# Altium project NUsense.PrjPCB
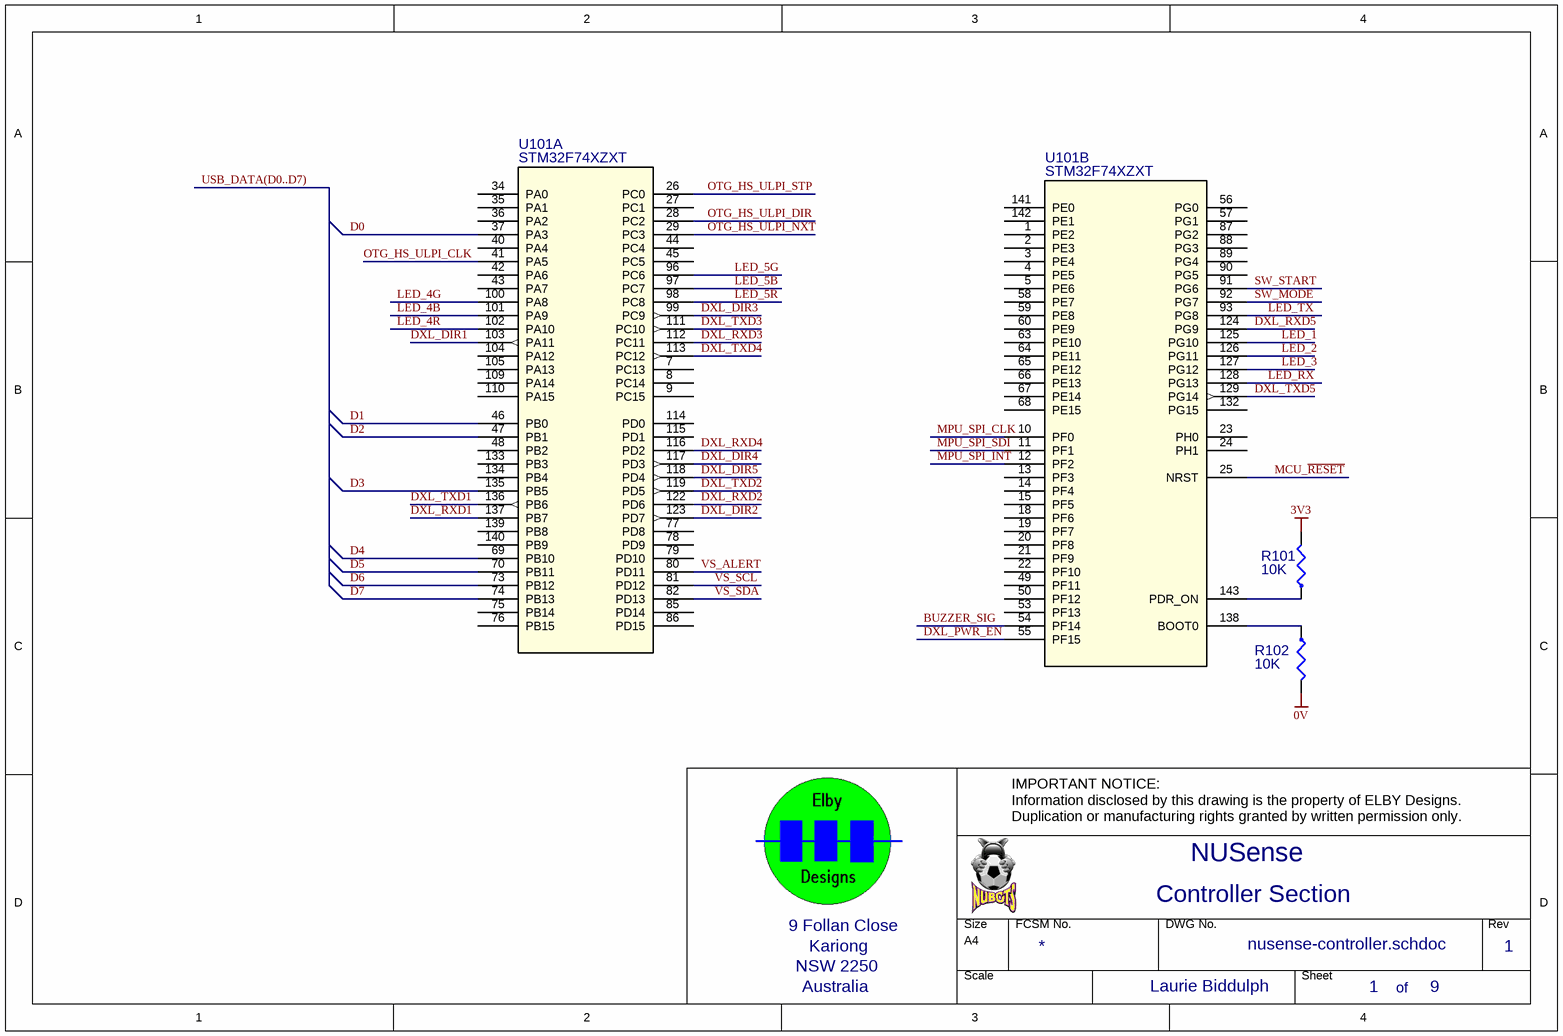
[diagram p0: nusense-controller.schdoc]
9 sheets, 204 parts. Net scope: global (net labels, ports and power ports of the same name join across sheets).
Sheets:
  nusense-controller.schdoc
  nusense-fans.schdoc
  nusense-monitors.schdoc
  nusense-mup-sensor.schdoc
  nusense-otg_hs_usb.schdoc
  nusense-power.schdoc
  nusense-power-decoupling.schdoc
  nusense-rs485.schdoc
  nusense-user-io.schdoc

## Sheet nusense-controller.schdoc: NUSense
size A4; Organization: Elby Designs; Address1: 9 Follan Close; Address2: Kariong; Address3: NSW 2250; Address4: Australia; Revision: 1; SheetNumber: 1; SheetTotal: 9; DrawnBy: Controller Section; Engineer: Laurie Biddulph; PageSetup: Record=PageOptions|CenterHorizontal=True|CenterVertical=True|PrintScale=1.38|XCorrection=1.00|YCorrection=1.00|PrintKind=1|BorderSize=5000000|LeftOffset=0|BottomOffset=0|Orientation=2|PaperLength=1000|PaperWidth=1000|Scale=100|PaperSource=7|PrintQuality=-4|MediaType=1|DitherType=10|PaperKind=A3|PrintScaleMode=1

### Parts
R101  10K  [AXIAL-0.4(LB)]
R102  10K  [AXIAL-0.4(LB)]
U101  STM32F74XZXT  [LQFP-144_20X20mm]  (parts A,B of 3)

### Nets
0V: R102.2
3V3: R101.2
BUZZER_SIG: U101.54(PF14)
D0: U101.37(PA3)
D1: U101.46(PB0)
D2: U101.47(PB1)
D3: U101.135(PB5)
D4: U101.69(PB10)
D5: U101.70(PB11)
D6: U101.73(PB12)
D7: U101.74(PB13)
DXL_DIR1: U101.103(PA11)
DXL_DIR2: U101.123(PD7)
DXL_DIR3: U101.99(PC9)
DXL_DIR4: U101.117(PD3)
DXL_DIR5: U101.118(PD4)
DXL_PWR_EN: U101.55(PF15)
DXL_RXD1: U101.137(PB7)
DXL_RXD2: U101.122(PD6)
DXL_RXD3: U101.112(PC11)
DXL_RXD4: U101.116(PD2)
DXL_RXD5: U101.124(PG9)
DXL_TXD1: U101.136(PB6)
DXL_TXD2: U101.119(PD5)
DXL_TXD3: U101.111(PC10)
DXL_TXD4: U101.113(PC12)
DXL_TXD5: U101.129(PG14)
LED_1: U101.125(PG10)
LED_2: U101.126(PG11)
LED_3: U101.127(PG12)
LED_4B: U101.101(PA9)
LED_4G: U101.100(PA8)
LED_4R: U101.102(PA10)
LED_5B: U101.97(PC7)
LED_5G: U101.96(PC6)
LED_5R: U101.98(PC8)
LED_RX: U101.128(PG13)
LED_TX: U101.93(PG8)
MCU_~{RESET}: U101.25(NRST)
MPU_SPI_CLK: U101.10(PF0)
MPU_SPI_INT: U101.12(PF2)
MPU_SPI_SDI: U101.11(PF1)
OTG_HS_ULPI_CLK: U101.41(PA5)
OTG_HS_ULPI_DIR: U101.28(PC2)
OTG_HS_ULPI_NXT: U101.29(PC3)
OTG_HS_ULPI_STP: U101.26(PC0)
SW_MODE: U101.92(PG7)
SW_START: U101.91(PG6)
VS_ALERT: U101.80(PD11)
VS_SCL: U101.81(PD12)
VS_SDA: U101.82(PD13)
NetR101_1: R101.1 U101.143(PDR_ON)
NetR102_1: R102.1 U101.138(BOOT0)

Not connected (* = marked no-connect by the designer): U101 1(PE2) 2(PE3) 3(PE4) 4(PE5) 5(PE6) 7(PC13) 8(PC14) 9(PC15) 13(PF3) 14(PF4) 15(PF5) 18(PF6) 19(PF7) 20(PF8) 21(PF9) 22(PF10) 23(PH0) 24(PH1) 27(PC1) 34(PA0) 35(PA1) 36(PA2) 40(PA4) 42(PA6) 43(PA7) 44(PC4) 45(PC5) 48(PB2) 49(PF11) 50(PF12) 53(PF13) 56(PG0) 57(PG1) 58(PE7) 59(PE8) 60(PE9) 63(PE10) 64(PE11) 65(PE12) 66(PE13) 67(PE14) 68(PE15) 75(PB14) 76(PB15) 77(PD8) 78(PD9) 79(PD10) 85(PD14) 86(PD15) 87(PG2) 88(PG3) 89(PG4) 90(PG5) 104(PA12) 105(PA13) 109(PA14) 110(PA15) 114(PD0) 115(PD1) 132(PG15) 133(PB3) 134(PB4) 139(PB8) 140(PB9) 141(PE0) 142(PE1)

### Buses and harness runs
bus USB_DATA(D0..D7)

### Notes on the sheet
- IMPORTANT NOTICE:
  Information disclosed by this drawing is the property of ELBY Designs.
  Duplication or manufacturing rights granted by written permission only.
- of

### Library data of the parts
R101 R102 = RM-10K(LB): 0.5W 1% Metal Film Resistor; EMRP: RM-10K
U101 = STM32F74XZXT: 32-bit Microcontroller; Vendor: STMicroelectronics; C: Copyright (C) 2016 Accelerated Designs. All rights reserved; Manufacturer_Part_Number: stm32f74xzxt; Copyright: Copyright (C) 2016 Accelerated Designs. All rights reserved; Value: Value; Type: Type; RefDes: RefDes

## Sheet nusense-fans.schdoc: NUSense
size A4; Organization: Elby Designs; Address1: 9 Follan Close; Address2: Kariong; Address3: NSW 2250; Address4: Australia; Revision: 1; SheetNumber: 4; SheetTotal: 9; DrawnBy: Fan Controller; Engineer: Laurie Biddulph; PageSetup: Record=PageOptions|CenterHorizontal=True|CenterVertical=True|PrintScale=1.38|XCorrection=1.00|YCorrection=1.00|PrintKind=1|BorderSize=5000000|LeftOffset=0|BottomOffset=0|Orientation=2|PaperLength=1000|PaperWidth=1000|Scale=100|PaperSource=7|PrintQuality=-4|MediaType=1|DitherType=10|PaperKind=A3|PrintScaleMode=1
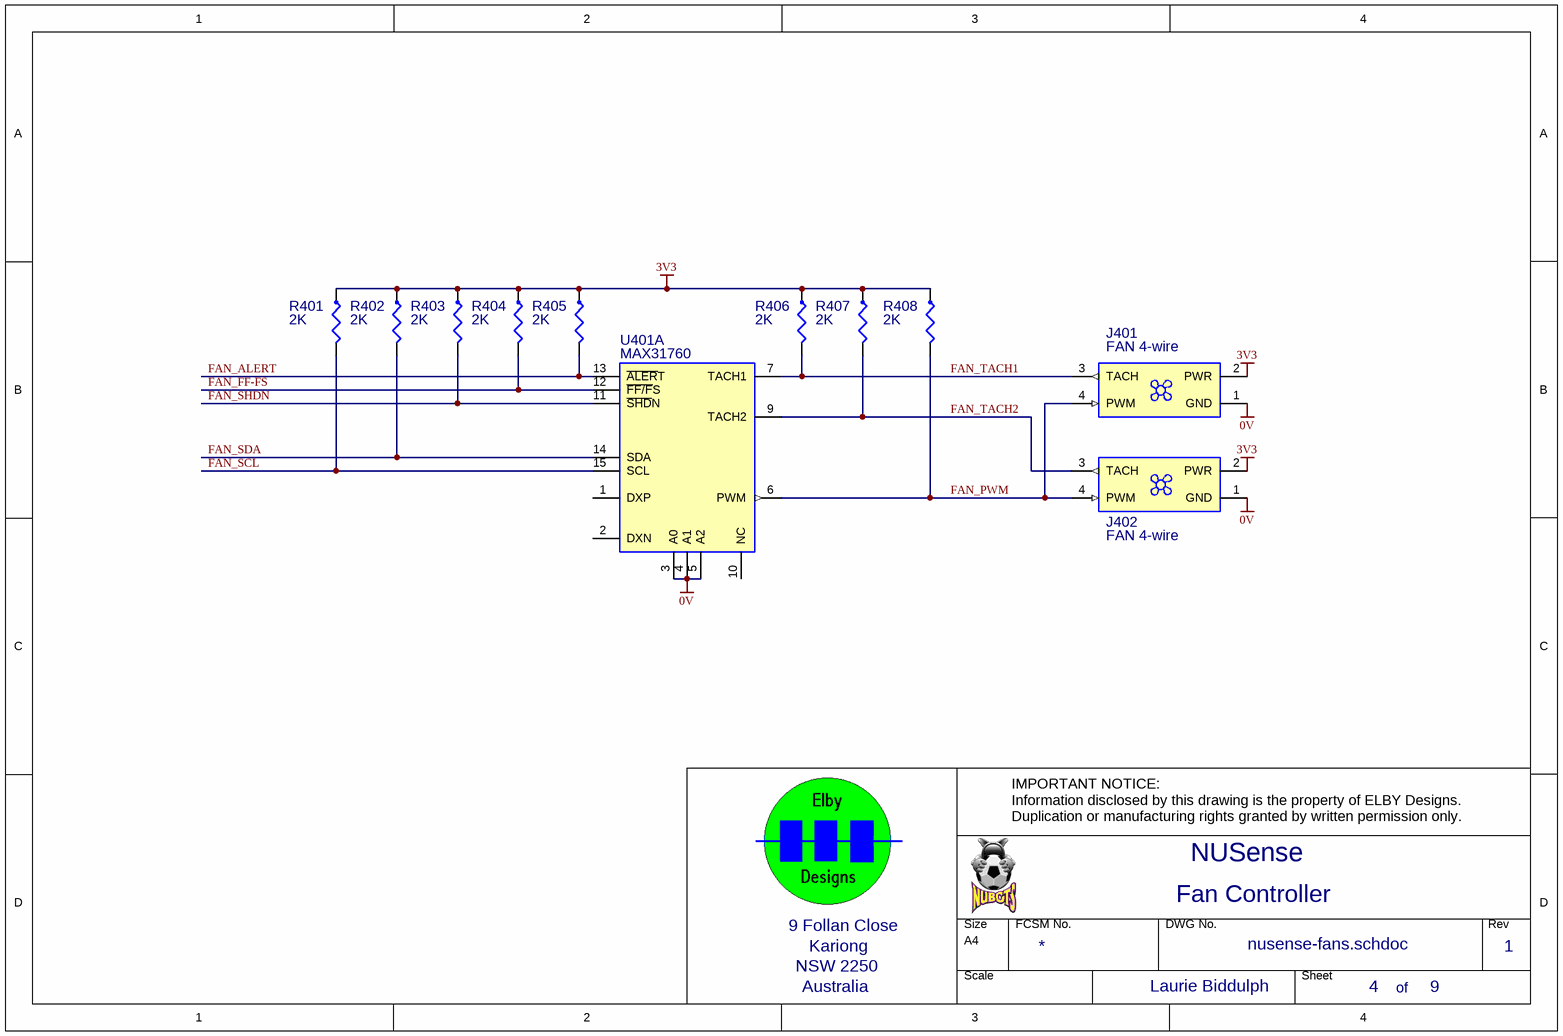
[diagram p1: nusense-fans.schdoc]

### Parts
J401  FAN 4-wire
J402  FAN 4-wire
R401  2K  [AXIAL-0.4(LB)]
R402  2K  [AXIAL-0.4(LB)]
R403  2K  [AXIAL-0.4(LB)]
R404  2K  [AXIAL-0.4(LB)]
R405  2K  [AXIAL-0.4(LB)]
R406  2K  [AXIAL-0.4(LB)]
R407  2K  [AXIAL-0.4(LB)]
R408  2K  [AXIAL-0.4(LB)]
U401  MAX31760  (part A of 2)

### Nets
0V: J401.1(GND) J402.1(GND) U401.3(A0) U401.4(A1) U401.5(A2)
3V3: J401.2(PWR) J402.2(PWR) R401.1 R402.1 R403.1 R404.1 R405.1 R406.1 R407.1 R408.1
FAN_ALERT: R405.2 U401.13(~{ALER}T)
FAN_FF-FS: R404.2 U401.12(~{FF/F}S)
FAN_PWM: J401.4(PWM) J402.4(PWM) R408.2 U401.6(PWM)
FAN_SCL: R401.2 U401.15(SCL)
FAN_SDA: R402.2 U401.14(SDA)
FAN_SHDN: R403.2 U401.11(~{SHD}N)
FAN_TACH1: J401.3(TACH) R406.2 U401.7(TACH1)
FAN_TACH2: J402.3(TACH) R407.2 U401.9(TACH2)

Not connected (* = marked no-connect by the designer): U401 1(DXP) 2(DXN) 10(NC)

### Notes on the sheet
- IMPORTANT NOTICE:
  Information disclosed by this drawing is the property of ELBY Designs.
  Duplication or manufacturing rights granted by written permission only.
- of

### Library data of the parts
J401 J402 = FAN-4wire: 4-Wire Fan
R401-R408 = RM-2K(LB): 0.5W 1% Metal Film Resistor; EMRP: RM-2K
U401 = MAX31760: Precision Fan Speed

## Sheet nusense-monitors.schdoc: NUSense
size A4; Organization: Elby Designs; Address1: 9 Follan Close; Address2: Kariong; Address3: NSW 2250; Address4: Australia; Revision: 1; SheetNumber: 0; SheetTotal: 0; DrawnBy: Current & Voltage Monitors; Engineer: Laurie Biddulph; PageSetup: Record=PageOptions|CenterHorizontal=True|CenterVertical=True|PrintScale=1.38|XCorrection=1.00|YCorrection=1.00|PrintKind=1|BorderSize=5000000|LeftOffset=0|BottomOffset=0|Orientation=2|PaperLength=1000|PaperWidth=1000|Scale=100|PaperSource=7|PrintQuality=-4|MediaType=1|DitherType=10|PaperKind=A3|PrintScaleMode=1
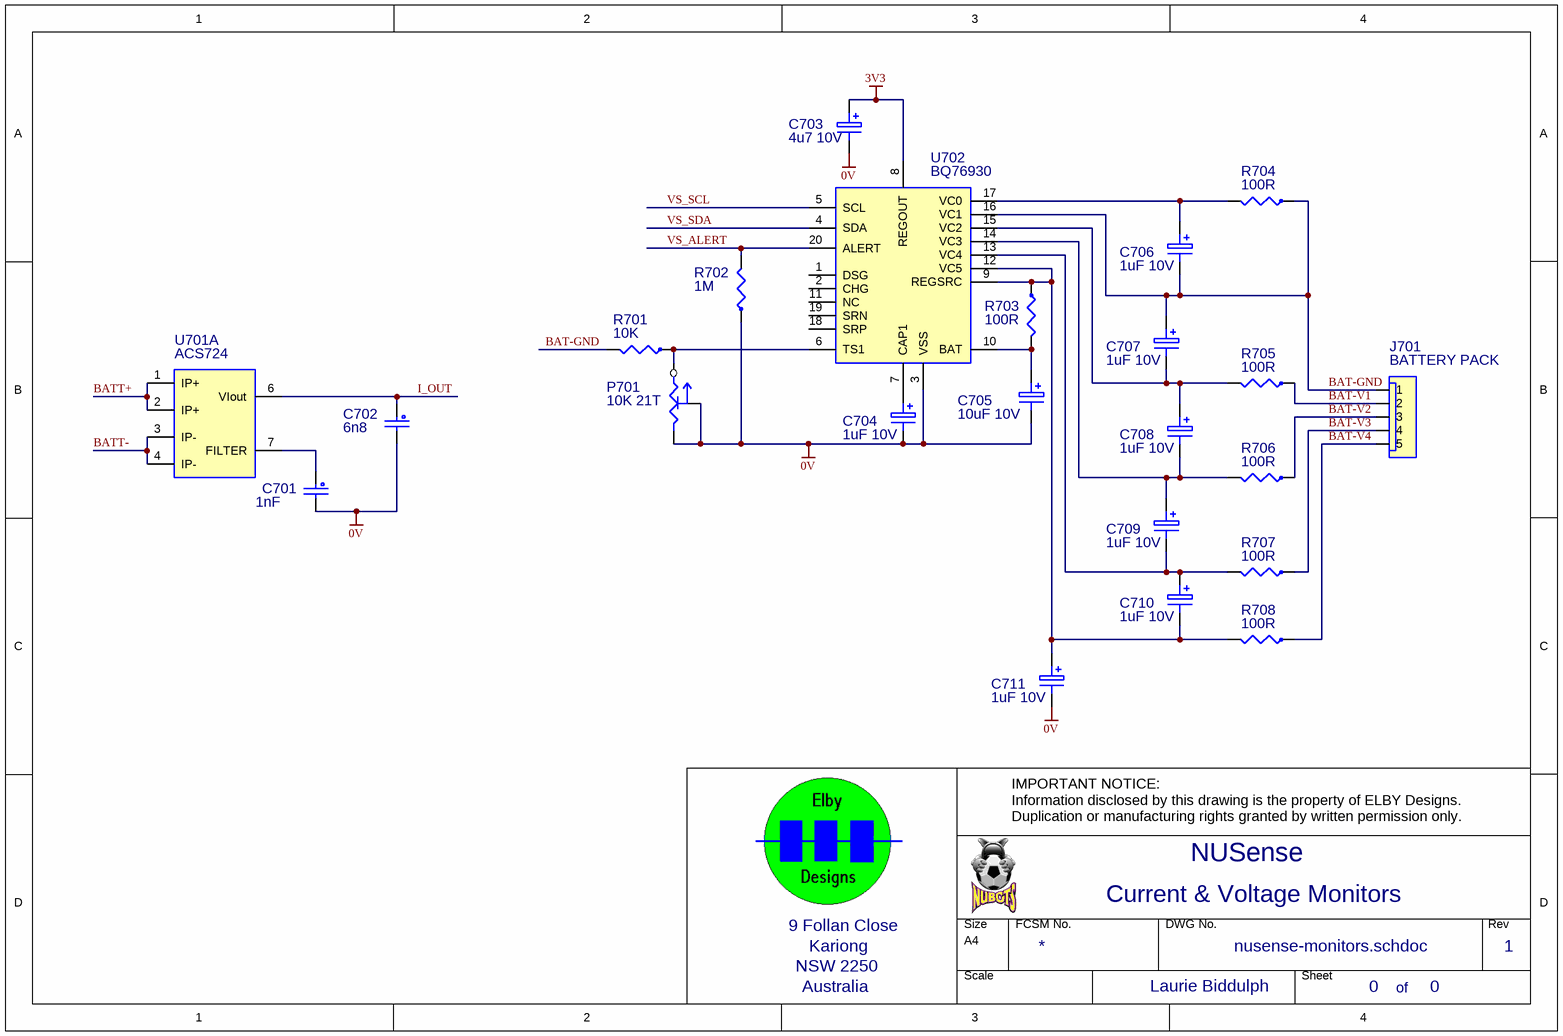
[diagram p2: nusense-monitors.schdoc]

### Parts
C701  1nF  [RAD-0.2(LB)]
C702  6n8  [RAD-0.2(LB)]
C703  4u7 10V  [RB-D5.0-P2.0]
C704  1uF 10V  [RB-D5.0-P2.0]
C705  10uF 10V  [RB-D6.3-P2.5]
C706  1uF 10V  [RB-D5.0-P2.0]
C707  1uF 10V  [RB-D5.0-P2.0]
C708  1uF 10V  [RB-D5.0-P2.0]
C709  1uF 10V  [RB-D5.0-P2.0]
C710  1uF 10V  [RB-D5.0-P2.0]
C711  1uF 10V  [RB-D5.0-P2.0]
J701  BATTERY PACK  [MTA-5V(LB)]
P701  10K 21T  [TRIMPOT(LB)]
R701  10K  [AXIAL-0.4(LB)]
R702  1M  [AXIAL-0.4(LB)]
R703  100R  [AXIAL-0.4(LB)]
R704  100R  [AXIAL-0.4(LB)]
R705  100R  [AXIAL-0.4(LB)]
R706  100R  [AXIAL-0.4(LB)]
R707  100R  [AXIAL-0.4(LB)]
R708  100R  [AXIAL-0.4(LB)]
U701  ACS724  (part A of 2)
U702  BQ76930

### Nets
0V: C701.2 C702.2 C703.2 C704.2 C705.2 C711.2 P701.1(A) P701.2(W) R702.1 U702.3(VSS)
3V3: C703.1 U702.8(REGOUT)
BAT-GND: C706.2 C707.1 J701.1 R701.2 R704.1 U702.16(VC1)
BAT-V1: J701.2 R705.1
BAT-V2: J701.3 R706.1
BAT-V3: J701.4 R707.1
BAT-V4: J701.5 R708.1
BATT+: U701.1(IP+) U701.2(IP+)
BATT-: U701.3(IP-) U701.4(IP-)
I_OUT: C702.1 U701.6(VIout)
VS_ALERT: R702.2 U702.20(ALERT)
VS_SCL: U702.5(SCL)
VS_SDA: U702.4(SDA)
NetC701_1: C701.1 U701.7(FILTER)
NetC704_1: C704.1 U702.7(CAP1)
NetC705_1: C705.1 R703.2 U702.10(BAT)
NetC706_1: C706.1 R704.2 U702.17(VC0)
NetC707_2: C707.2 C708.1 R705.2 U702.15(VC2)
NetC708_2: C708.2 C709.1 R706.2 U702.14(VC3)
NetC709_2: C709.2 C710.1 R707.2 U702.13(VC4)
NetC710_2: C710.2 C711.1 R703.1 R708.2 U702.9(REGSRC) U702.12(VC5)
NetP701_3: P701.3(C) R701.1 U702.6(TS1)

Not connected (* = marked no-connect by the designer): U702 1(DSG) 2(CHG) 11(NC) 18(SRP) 19(SRN)

### Notes on the sheet
- IMPORTANT NOTICE:
  Information disclosed by this drawing is the property of ELBY Designs.
  Duplication or manufacturing rights granted by written permission only.
- of

### Library data of the parts
C701 = CP-1NF(LB): 63V 10% Metallised Polyester; EMRP: CP-1N0F
C702 = CP-6N8F(LB): 63V 10% Metallised Polyester; EMRP: CP-6N8F
C703 = CE-4U7F50V(LB): 20% 50V Aluminium Electrolytic; EMRP: CE-4U7F
C704 C706-C711 = CE-1UF50V(LB): 20% 50V Aluminium Electrolytic; EMRP: CE-1UF
C705 = CE-10UF50V(LB): 20% 50V Aluminium Electrolytic; EMRP: CE-10UF
J701 = MTA-5V(LB): EMRP: JC-05P
P701 = RT-10K(LB): Multiturn Trimpot (Spectrol 64W); EMRP: RT-6-10K
R701 = RM-10K(LB): as R101 on sheet nusense-controller
R702 = RM-1M(LB): 0.5W 1% Metal Film Resistor; EMRP: RM-1M
R703-R708 = RM-100R(LB): 0.5W 1% Metal Film Resistor; EMRP: RM-100R
U701 = ACS724: Current Monitor
U702 = BQ76930: Battery Monitor

## Sheet nusense-mup-sensor.schdoc: NUSense
size A4; Organization: Elby Designs; Address1: 9 Follan Close; Address2: Kariong; Address3: NSW 2250; Address4: Australia; Revision: 1; SheetNumber: 2; SheetTotal: 9; DrawnBy: MPU Sensor; Engineer: Laurie Biddulph; PageSetup: Record=PageOptions|CenterHorizontal=True|CenterVertical=True|PrintScale=1.38|XCorrection=1.00|YCorrection=1.00|PrintKind=1|BorderSize=5000000|LeftOffset=0|BottomOffset=0|Orientation=2|PaperLength=1000|PaperWidth=1000|Scale=100|PaperSource=7|PrintQuality=-4|MediaType=1|DitherType=10|PaperKind=A3|PrintScaleMode=1
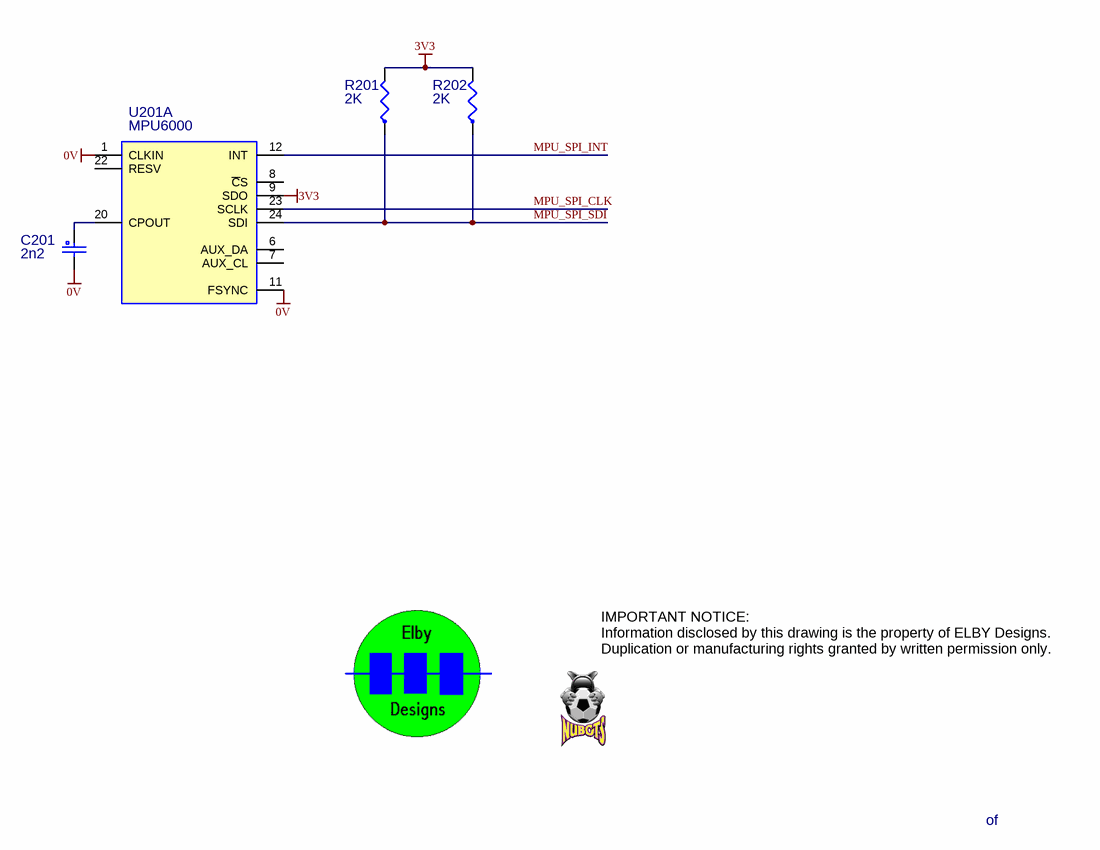
[diagram p3: nusense-mup-sensor.schdoc]

### Parts
C201  2n2  [RAD-0.2(LB)]
R201  2K  [AXIAL-0.4(LB)]
R202  2K  [AXIAL-0.4(LB)]
U201  MPU6000  (part A of 3)

### Nets
0V: C201.2 U201.1(CLKIN) U201.11(FSYNC)
3V3: R201.2 R202.2 U201.9(SDO)
MPU_SPI_CLK: U201.23(SCLK)
MPU_SPI_INT: U201.12(INT)
MPU_SPI_SDI: R201.1 R202.1 U201.24(SDI)
NetC201_1: C201.1 U201.20(CPOUT)

Not connected (* = marked no-connect by the designer): U201 6(AUX_DA) 7(AUX_CL) 8(~{C}S) 22(RESV)

### Notes on the sheet
- IMPORTANT NOTICE:
  Information disclosed by this drawing is the property of ELBY Designs.
  Duplication or manufacturing rights granted by written permission only.
- of

### Library data of the parts
C201 = CP-2N2F(LB): 63V 10% Metallised Polyester; EMRP: CP-2N2F
R201 R202 = RM-2K(LB): 0.5W 1% Metal Film Resistor; EMRP: RM-2K
U201 = MPU6000: Motion Tracking

## Sheet nusense-otg_hs_usb.schdoc: NUSense
size A4; Organization: Elby Designs; Address1: 9 Follan Close; Address2: Kariong; Address3: NSW 2250; Address4: Australia; Revision: 1; SheetNumber: 3; SheetTotal: 9; DrawnBy: USB Section; Engineer: Laurie Biddulph; PageSetup: Record=PageOptions|CenterHorizontal=True|CenterVertical=True|PrintScale=1.38|XCorrection=1.00|YCorrection=1.00|PrintKind=1|BorderSize=5000000|LeftOffset=0|BottomOffset=0|Orientation=2|PaperLength=1000|PaperWidth=1000|Scale=100|PaperSource=7|PrintQuality=-4|MediaType=1|DitherType=10|PaperKind=A3|PrintScaleMode=1
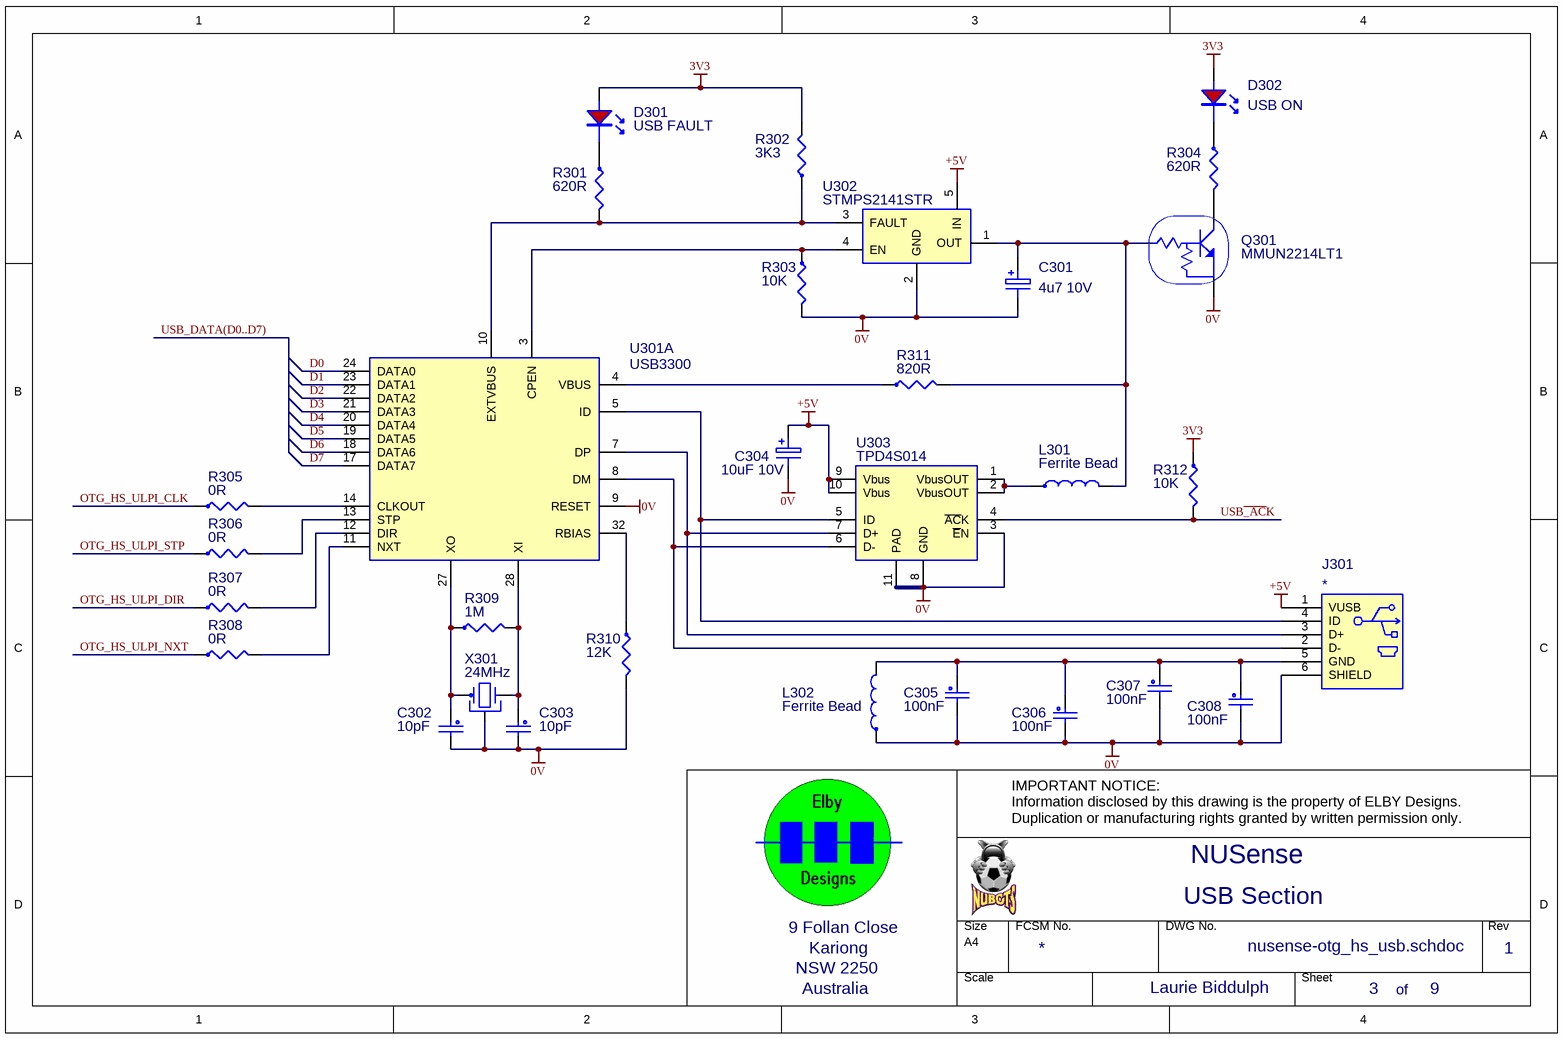
[diagram p4: nusense-otg_hs_usb.schdoc]

### Parts
C301  4u7 10V  [RB-D5.0-P2.0]
C302  10pF  [RAD-0.2N(LB)]
C303  10pF  [RAD-0.2N(LB)]
C304  10uF 10V  [RB-D6.3-P2.5]
C305  100nF  [RAD-0.2N(LB)]
C306  100nF  [RAD-0.2N(LB)]
C307  100nF  [RAD-0.2N(LB)]
C308  100nF  [RAD-0.2N(LB)]
D301  USB FAULT  [LED-PCB(LB)]
D302  USB ON  [LED-PCB(LB)]
J301  *
L301  Ferrite Bead  [AXIAL-0.3IND(LB)]
L302  Ferrite Bead  [AXIAL-0.3IND(LB)]
Q301  MMUN2214LT1  [SOT-23(LB)]
R301  620R  [AXIAL-0.4(LB)]
R302  3K3  [AXIAL-0.4(LB)]
R303  10K  [AXIAL-0.4(LB)]
R304  620R  [AXIAL-0.4(LB)]
R305  0R  [AXIAL-0.4(LB)]
R306  0R  [AXIAL-0.4(LB)]
R307  0R  [AXIAL-0.4(LB)]
R308  0R  [AXIAL-0.4(LB)]
R309  1M  [AXIAL-0.4(LB)]
R310  12K  [AXIAL-0.4(LB)]
R311  820R  [AXIAL-0.4(LB)]
R312  10K  [AXIAL-0.4(LB)]
U301  USB3300  [QFN-32_L]  (part A of 2)
U302  STMPS2141STR  [SOT-23-5(LB)]
U303  TPD4S014
X301  24MHz  [CRYSTAL-3(LB)]

### Nets
0V: C301.2 C302.2 C303.2 C304.2 C305.2 C306.2 C307.2 C308.2 J301.6(SHIELD) L302.1 Q301.2(E) R303.2 R310.2 U301.9(RESET) U302.2(GND) U303.3(~{E}N) U303.8(GND) U303.11(PAD) X301.3
3V3: D301.A D302.A R302.2 R312.1
+5V: C304.1 J301.1(VUSB) U302.5(IN) U303.9(Vbus) U303.10(Vbus)
D0: U301.24(DATA0)
D1: U301.23(DATA1)
D2: U301.22(DATA2)
D3: U301.21(DATA3)
D4: U301.20(DATA4)
D5: U301.19(DATA5)
D6: U301.18(DATA6)
D7: U301.17(DATA7)
OTG_HS_ULPI_CLK: R305.1
OTG_HS_ULPI_DIR: R307.1
OTG_HS_ULPI_NXT: R308.1
OTG_HS_ULPI_STP: R306.1
USB~{_AC}K: R312.2 U303.4(~{AC}K)
NetC301_1: C301.1 L301.2 Q301.1(B) R311.2 U302.1(OUT)
NetC302_1: C302.1 R309.1 U301.27(XO) X301.1
NetC303_1: C303.1 R309.2 U301.28(XI) X301.2
NetC305_1: C305.1 C306.1 C307.1 C308.1 J301.5(GND) L302.2
NetD301_K: D301.K R301.1
NetD302_K: D302.K R304.1
NetJ301_2: J301.2(D-) U301.8(DM) U303.6(D-)
NetJ301_3: J301.3(D+) U301.7(DP) U303.7(D+)
NetJ301_4: J301.4(ID) U301.5(ID) U303.5(ID)
NetL301_1: L301.1 U303.1(VbusOUT) U303.2(VbusOUT)
NetQ301_3: Q301.3(C) R304.2
NetR301_2: R301.2 R302.1 U301.10(EXTVBUS) U302.3(FAULT)
NetR303_1: R303.1 U301.3(CPEN) U302.4(EN)
NetR305_2: R305.2 U301.14(CLKOUT)
NetR306_2: R306.2 U301.13(STP)
NetR307_2: R307.2 U301.12(DIR)
NetR308_2: R308.2 U301.11(NXT)
NetR310_1: R310.1 U301.32(RBIAS)
NetR311_1: R311.1 U301.4(VBUS)

### Buses and harness runs
bus USB_DATA(D0..D7)

### Notes on the sheet
- IMPORTANT NOTICE:
  Information disclosed by this drawing is the property of ELBY Designs.
  Duplication or manufacturing rights granted by written permission only.
- of

### Library data of the parts
C301 = CE-4U7F50V(LB): 20% 50V Aluminium Electrolytic; EMRP: CE-4U7F
C302 C303 = CC-10PF(LB): NPO Low K, 50VDC Ceramic Disc; EMRP: CC-10PF
C304 = CE-10UF50V(LB): 20% 50V Aluminium Electrolytic; EMRP: CE-10UF
C305-C308 = CC-100NF(LB): Monolithic Ceramic; EMRP: CC-100NF
D301 D302 = LED-RED(LB): LED
J301 = ZX62D-B-5P8
L301 L302 = FERRITE-BEAD(LB): EMRP: IN-BEAD
Q301 = MMUN2214LT1(SMD): NPN Digital Transistor; EMRP: SM-T-MMUN2214LT1
R301 R304 = RM-620R(LB): 0.5W 1% Metal Film Resistor; EMRP: RM-620R
R302 = RM-3K3(LB): 0.5W 1% Metal Film Resistor; EMRP: RM-3K3
R303 R312 = RM-10K(LB): as R101 on sheet nusense-controller
R305-R308 = RM-SC(LB): Resistor - Short Circuit; EMRP: NA
R309 = RM-1M(LB): 0.5W 1% Metal Film Resistor; EMRP: RM-1M
R310 = RM-12K(LB): 0.5W 1% Metal Film Resistor; EMRP: RM-12K
R311 = RM-820R(LB): 0.5W 1% Metal Film Resistor; EMRP: RM-820R
U301 = USB3300: USB Host Controller
U302 = STMPS2141: Power Switch
U303 = TPD4S014: USB Charger Port Protector
X301 = XTAL-24MHZ(LB): 24MHz Parallel-cut Crystal - HC49; EMRP: ZT-20MHZ

## Sheet nusense-power.schdoc: NUSense
size A4; Organization: Elby Designs; Address1: 9 Follan Close; Address2: Kariong; Address3: NSW 2250; Address4: Australia; Revision: 1; SheetNumber: 8; SheetTotal: 9; DrawnBy: Power Supply; Engineer: Laurie Biddulph; PageSetup: Record=PageOptions|CenterHorizontal=True|CenterVertical=True|PrintScale=1.38|XCorrection=1.00|YCorrection=1.00|PrintKind=1|BorderSize=5000000|LeftOffset=0|BottomOffset=0|Orientation=2|PaperLength=1000|PaperWidth=1000|Scale=100|PaperSource=7|PrintQuality=-4|MediaType=1|DitherType=10|PaperKind=A3|PrintScaleMode=1
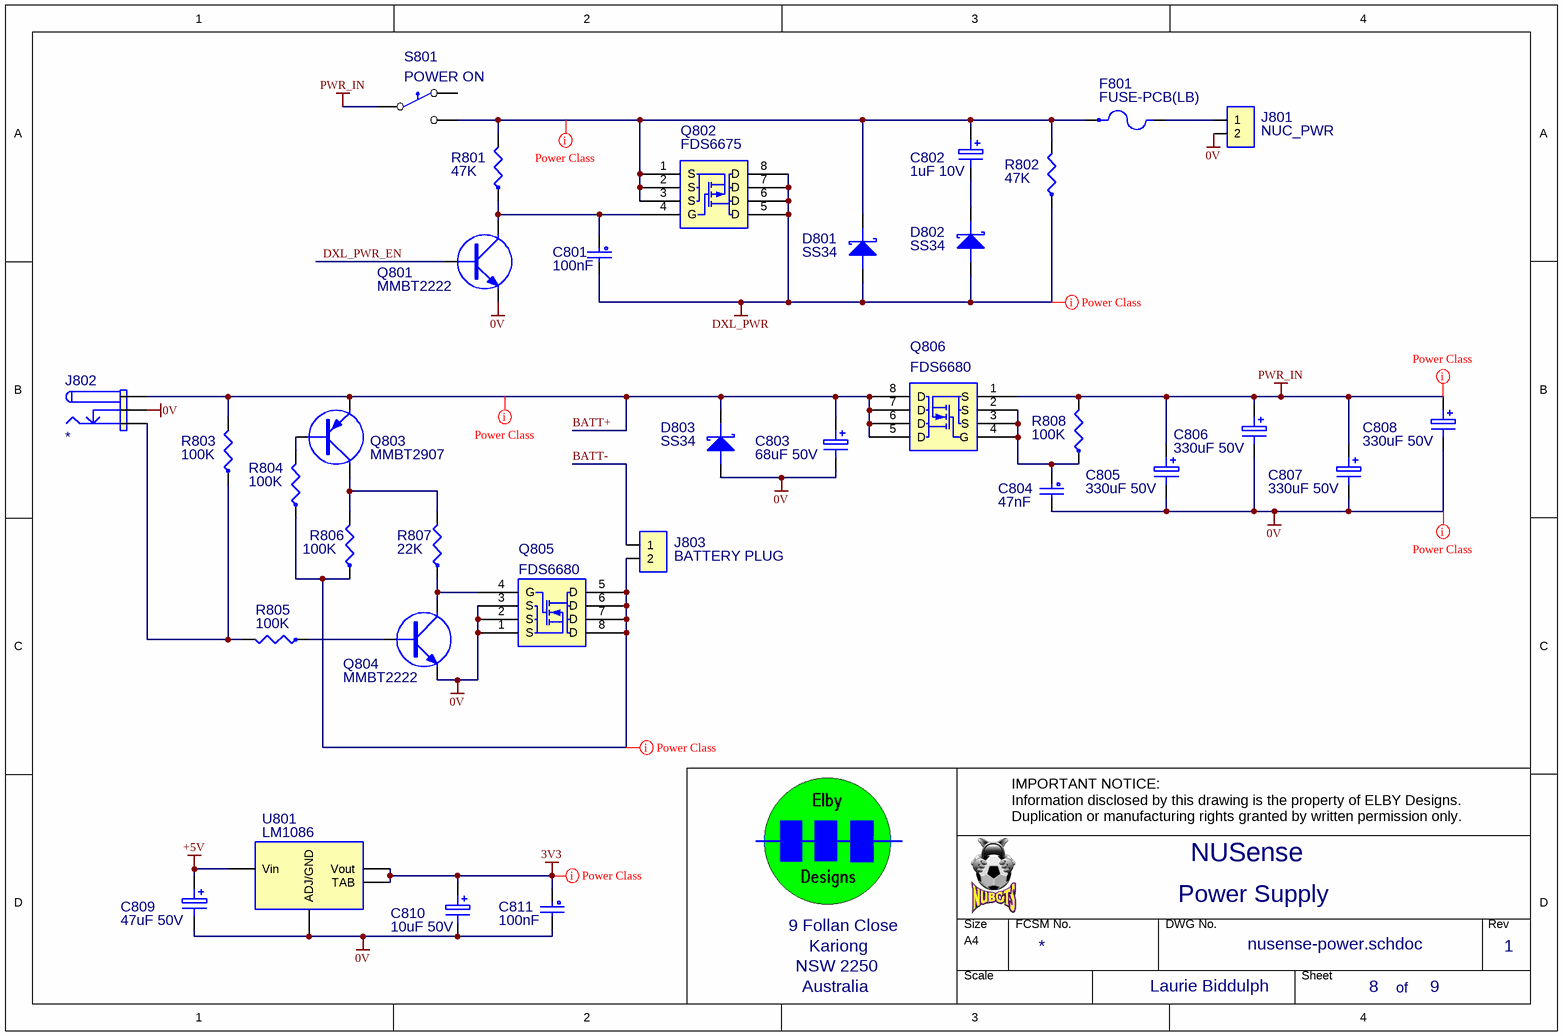
[diagram p5: nusense-power.schdoc]

### Parts
C801  100nF  [RAD-0.2N(LB)]
C802  1uF 10V  [RB-D5.0-P2.0]
C803  68uF 50V  [RB-D6.3-P2.5]
C804  47nF  [RAD-0.2(LB)]
C805  330uF 50V  [RB-D6.3-P2.5]
C806  330uF 50V  [RB-D6.3-P2.5]
C807  330uF 50V  [RB-D6.3-P2.5]
C808  330uF 50V  [RB-D6.3-P2.5]
C809  47uF 50V  [RB-D6.3-P2.5]
C810  10uF 50V  [RB-D6.3-P2.5]
C811  100nF  [RAD-0.2N(LB)]
D801  SS34  [DO-214AB (SMC)]
D802  SS34  [DO-214AB (SMC)]
D803  SS34  [DO-214AB (SMC)]
F801  FUSE-PCB(LB)  [FUSE20MM(LB)]
J801  NUC_PWR  [TERM254-2(LB)]
J802  *  [PCB-DC-SOCKET]
J803  BATTERY PLUG  [TERM254-2(LB)]
Q801  MMBT2222  [SOT-23(LB)]
Q802  FDS6675  [SO-8]
Q803  MMBT2907  [SOT-23(LB)]
Q804  MMBT2222  [SOT-23(LB)]
Q805  FDS6680  [SO-8]
Q806  FDS6680  [SO-8]
R801  47K  [AXIAL-0.4(LB)]
R802  47K  [AXIAL-0.4(LB)]
R803  100K  [AXIAL-0.4(LB)]
R804  100K  [AXIAL-0.4(LB)]
R805  100K  [AXIAL-0.4(LB)]
R806  100K  [AXIAL-0.4(LB)]
R807  22K  [AXIAL-0.4(LB)]
R808  100K  [AXIAL-0.4(LB)]
S801  POWER ON  [SW-SPDT-SLIDE-RA(LB)]
U801  LM1086  [TO220-VHS-B(LB)]

### Nets
0V: C803.2 C804.2 C805.2 C806.2 C807.2 C808.2 C809.2 C810.2 C811.2 D803.A J801.2 J802.2(SWITCHED-BODY) Q801.2(E) Q804.2(E) Q805.1(S) Q805.2(S) Q805.3(S) U801.1(ADJ/GND)
3V3: C810.1 C811.1 U801.2(Vout) U801.TAB
+5V: C809.1 U801.3(Vin)
DXL_PWR: C801.2 D801.A D802.A Q802.5(D) Q802.6(D) Q802.7(D) Q802.8(D) R802.1
PWR_IN: C805.1 C806.1 C807.1 C808.1 Q806.1(S) R808.2 S801.1(COM)
BATT+: C803.1 D803.K J802.1(TIP) Q803.2(E) Q806.5(D) Q806.6(D) Q806.7(D) Q806.8(D) R803.2
BATT-: J803.1
DXL_PWR_EN: Q801.1(B)
NetC801_1: C801.1 Q801.3(C) Q802.4(G) R801.1
NetC802_1: C802.1 D801.K F801.1 Q802.1(S) Q802.2(S) Q802.3(S) R801.2 R802.2 S801.2(NO)
NetC802_2: C802.2 D802.K
NetC804_1: C804.1 Q806.2(S) Q806.3(S) Q806.4(G) R808.1
NetF801_2: F801.2 J801.1
NetJ802_3: J802.3(Body) R803.1 R805.2
NetJ803_2: J803.2 Q805.5(D) Q805.6(D) Q805.7(D) Q805.8(D) R804.1 R806.1
NetQ803_1: Q803.1(B) R804.2
NetQ803_3: Q803.3(C) R806.2 R807.2
NetQ804_1: Q804.1(B) R805.1
NetQ804_3: Q804.3(C) Q805.4(G) R807.1

Not connected (* = marked no-connect by the designer): S801 3(NC)

### Layout directives
net class PowerClass: 0V, 3V3, BATT+, DXL_PWR, NetC802_1, NetJ803_2, PWR_IN

### Notes on the sheet
- IMPORTANT NOTICE:
  Information disclosed by this drawing is the property of ELBY Designs.
  Duplication or manufacturing rights granted by written permission only.
- of

### Library data of the parts
C801 C811 = CC-100NF(LB): Monolithic Ceramic; EMRP: CC-100NF
C802 = CE-1UF50V(LB): as C704 on sheet nusense-monitors
C803 = CE-68UF50V(LB): 20% 50V Aluminium Electrolytic; EMRP: CE-47UF
C804 = CP-47NF(LB): 63V 10% Metallised Polyester; EMRP: CP-47NF
C805-C808 = CE-330UF50V(LB): 20% 50V Aluminium Electrolytic; EMRP: CE-47UF
C809 = CE-47UF50V(LB): 20% 50V Aluminium Electrolytic; EMRP: CE-47UF
C810 = CE-10UF50V(LB): 20% 50V Aluminium Electrolytic; EMRP: CE-10UF
D801-D803 = SS34(LB): 40V, 3A Sschottky Rectifier; Text Field1: 330*101040
F801 = FUSE-PCB(LB): PCB Fuse Holder and Fuse
J801 J803 = CON2(LB): Text Field2: HM-3412 + HM-3402
J802 = DC2.5MM-PCBV(LB): Switched 2.5mm DC Connector - PCB; EMRP: JP-2.5MM-PAN
Q801 Q804 = MMBT2222(SMD): NPN Transistor; EMRP: SM-T-MMBT2222
Q802 = FDS6675: 40V P-Channel PowerTrench MOSFET; Text Field1: 340*101620; Comment_1: *
Q803 = MMBT2907(SMD): PNP Transistor; EMRP: SM-T-MMBT2907
Q805 Q806 = FDS6680: 30V N-Channel PowerTrench MOSFET; Comment_1: *
R801 R802 = RM-47K(LB): 0.5W 1% Metal Film Resistor; EMRP: RM-47K
R803-R806 R808 = RM-100K(LB): 0.5W 1% Metal Film Resistor; EMRP: RM-100K
R807 = RM-22K(LB): 0.5W 1% Metal Film Resistor; EMRP: RM-22K
S801 = SW-SPDT_11(LB): Single-pole, Double-throw Switch
U801 = LM1086(LB): 3-terminal Positive Voltage Regulator; Text Field1: 347-6870; Text Field2: ZV-1615; Text Field3: 512-KA317

## Sheet nusense-power-decoupling.schdoc: NUSense
size A4; Organization: Elby Designs; Address1: 9 Follan Close; Address2: Kariong; Address3: NSW 2250; Address4: Australia; Revision: 1; SheetNumber: 9; SheetTotal: 9; DrawnBy: Power Supply Decoupling; Engineer: Laurie Biddulph; PageSetup: Record=PageOptions|CenterHorizontal=True|CenterVertical=True|PrintScale=1.38|XCorrection=1.00|YCorrection=1.00|PrintKind=1|BorderSize=5000000|LeftOffset=0|BottomOffset=0|Orientation=2|PaperLength=1000|PaperWidth=1000|Scale=100|PaperSource=7|PrintQuality=-4|MediaType=1|DitherType=10|PaperKind=A3|PrintScaleMode=1
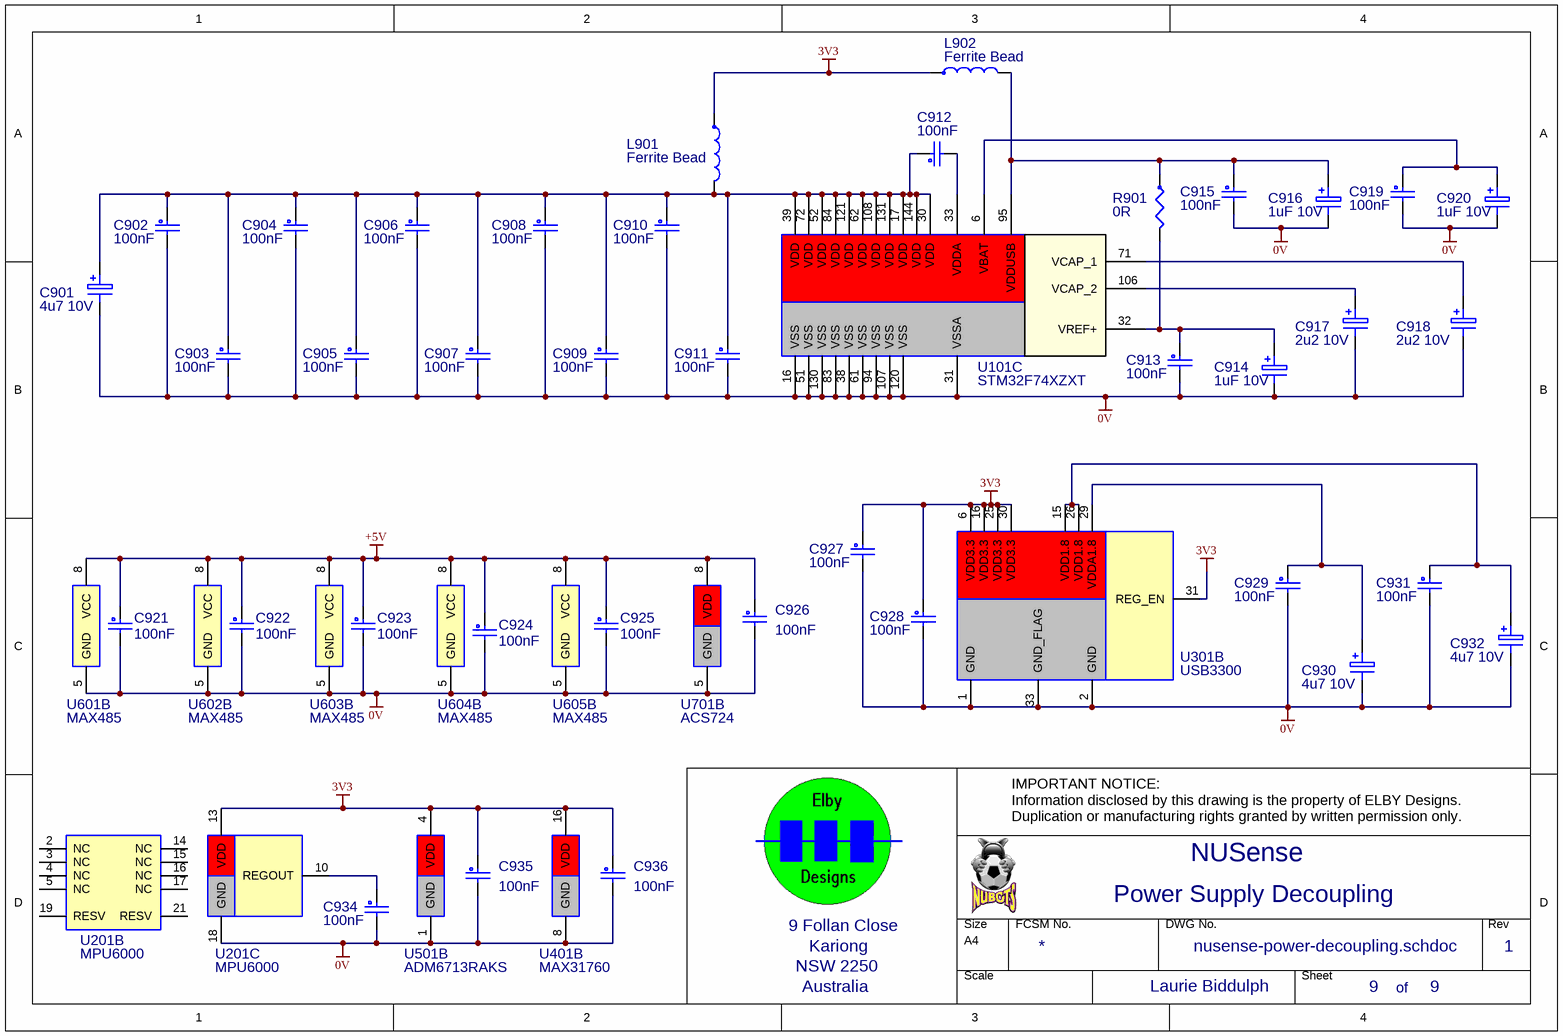
[diagram p6: nusense-power-decoupling.schdoc]

### Parts
C901  4u7 10V  [RB-D5.0-P2.0]
C902  100nF  [RAD-0.2N(LB)]
C903  100nF  [RAD-0.2N(LB)]
C904  100nF  [RAD-0.2N(LB)]
C905  100nF  [RAD-0.2N(LB)]
C906  100nF  [RAD-0.2N(LB)]
C907  100nF  [RAD-0.2N(LB)]
C908  100nF  [RAD-0.2N(LB)]
C909  100nF  [RAD-0.2N(LB)]
C910  100nF  [RAD-0.2N(LB)]
C911  100nF  [RAD-0.2N(LB)]
C912  100nF  [RAD-0.2N(LB)]
C913  100nF  [RAD-0.2N(LB)]
C914  1uF 10V  [RB-D5.0-P2.0]
C915  100nF  [RAD-0.2N(LB)]
C916  1uF 10V  [RB-D5.0-P2.0]
C917  2u2 10V  [RB-D5.0-P2.0]
C918  2u2 10V  [RB-D5.0-P2.0]
C919  100nF  [RAD-0.2N(LB)]
C920  1uF 10V  [RB-D5.0-P2.0]
C921  100nF  [RAD-0.2N(LB)]
C922  100nF  [RAD-0.2N(LB)]
C923  100nF  [RAD-0.2N(LB)]
C924  100nF  [RAD-0.2N(LB)]
C925  100nF  [RAD-0.2N(LB)]
C926  100nF  [RAD-0.2N(LB)]
C927  100nF  [RAD-0.2N(LB)]
C928  100nF  [RAD-0.2N(LB)]
C929  100nF  [RAD-0.2N(LB)]
C930  4u7 10V  [RB-D5.0-P2.0]
C931  100nF  [RAD-0.2N(LB)]
C932  4u7 10V  [RB-D5.0-P2.0]
C934  100nF  [RAD-0.2N(LB)]
C935  100nF  [RAD-0.2N(LB)]
C936  100nF  [RAD-0.2N(LB)]
L901  Ferrite Bead  [AXIAL-0.3IND(LB)]
L902  Ferrite Bead  [AXIAL-0.3IND(LB)]
R901  0R  [AXIAL-0.4(LB)]
U101  STM32F74XZXT  [LQFP-144_20X20mm]  (part C of 3)
U201  MPU6000  (parts B,C of 3)
U301  USB3300  [QFN-32_L]  (part B of 2)
U401  MAX31760  (part B of 2)
U501  ADM6713RAKS  (part B of 2)
U601  MAX485  [DIP-8(LB)]  (part B of 2)
U602  MAX485  [DIP-8(LB)]  (part B of 2)
U603  MAX485  [DIP-8(LB)]  (part B of 2)
U604  MAX485  [DIP-8(LB)]  (part B of 2)
U605  MAX485  [DIP-8(LB)]  (part B of 2)
U701  ACS724  (part B of 2)

### Nets
0V: C901.2 C902.2 C903.2 C904.2 C905.2 C906.2 C907.2 C908.2 C909.2 C910.2 C911.2 C913.2 C914.2 C915.2 C916.2 C917.2 C918.2 C919.2 C920.2 C921.2 C922.2 C923.2 C924.2 C925.2 C926.2 C927.2 C928.2 C929.2 C930.2 C931.2 C932.2 C934.2 C935.2 C936.2 U101.16(VSS) U101.31(VSSA) U101.38(VSS) U101.51(VSS) U101.61(VSS) U101.83(VSS) U101.94(VSS) U101.107(VSS) U101.120(VSS) U101.130(VSS) U201.18(GND) U301.1(GND) U301.2(GND) U301.33(GND_FLAG) U401.8(GND) U501.1(GND) U601.5(GND) U602.5(GND) U603.5(GND) U604.5(GND) U605.5(GND) U701.5(GND)
3V3: C927.1 C928.1 C935.1 C936.1 L901.1 L902.1 U201.13(VDD) U301.6(VDD3.3) U301.16(VDD3.3) U301.25(VDD3.3) U301.30(VDD3.3) U301.31(REG_EN) U401.16(VDD) U501.4(VDD)
+5V: C921.1 C922.1 C923.1 C924.1 C925.1 C926.1 U601.8(VCC) U602.8(VCC) U603.8(VCC) U604.8(VCC) U605.8(VCC) U701.8(VDD)
NetC901_1: C901.1 C902.1 C903.1 C904.1 C905.1 C906.1 C907.1 C908.1 C909.1 C910.1 C911.1 C912.1 L901.2 U101.17(VDD) U101.30(VDD) U101.39(VDD) U101.52(VDD) U101.62(VDD) U101.72(VDD) U101.84(VDD) U101.108(VDD) U101.121(VDD) U101.131(VDD) U101.144(VDD)
NetC912_2: C912.2 U101.33(VDDA)
NetC913_1: C913.1 C914.1 R901.2 U101.32(VREF+)
NetC915_1: C915.1 C916.1 L902.2 R901.1 U101.95(VDDUSB)
NetC917_1: C917.1 U101.106(VCAP_2)
NetC918_1: C918.1 U101.71(VCAP_1)
NetC919_1: C919.1 C920.1 U101.6(VBAT)
NetC929_1: C929.1 C930.1 U301.29(VDDA1.8)
NetC931_1: C931.1 C932.1 U301.15(VDD1.8) U301.26(VDD1.8)
NetC934_1: C934.1 U201.10(REGOUT)

Not connected (* = marked no-connect by the designer): U201 2(NC) 3(NC) 4(NC) 5(NC) 14(NC) 15(NC) 16(NC) 17(NC) 19(RESV) 21(RESV)

### Notes on the sheet
- IMPORTANT NOTICE:
  Information disclosed by this drawing is the property of ELBY Designs.
  Duplication or manufacturing rights granted by written permission only.
- of

### Library data of the parts
C901 C930 C932 = CE-4U7F50V(LB): 20% 50V Aluminium Electrolytic; EMRP: CE-4U7F
C902-C913 C915 C919 C921-C929 C931 C934-C936 = CC-100NF(LB): Monolithic Ceramic; EMRP: CC-100NF
C914 C916 C920 = CE-1UF50V(LB): as C704 on sheet nusense-monitors
C917 C918 = CE-2U2F50V(LB): 20% 50V Aluminium Electrolytic; EMRP: CE-2U2F
L901 L902 = FERRITE-BEAD(LB): EMRP: IN-BEAD
R901 = RM-SC(LB): Resistor - Short Circuit; EMRP: NA
U101 = STM32F74XZXT: as U101 on sheet nusense-controller; Manufacturer_Part_Number: stm32f74xzxt; Copyright: Copyright (C) 2016 Accelerated Designs. All rights reserved; Value: Value; Type: Type; RefDes: RefDes
U201 = MPU6000: Motion Tracking
U301 = USB3300: USB Host Controller
U401 = MAX31760: Precision Fan Speed
U501 = ADM6713
U601-U605 = MAX485(LB): Low-power, Slew-rate limited RS485/RS422 Transceiver; EMRP: SI-1-MAX485
U701 = ACS724: Current Monitor

## Sheet nusense-rs485.schdoc: NUSense
size A4; Organization: Elby Designs; Address1: 9 Follan Close; Address2: Kariong; Address3: NSW 2250; Address4: Australia; Revision: 1; SheetNumber: 6; SheetTotal: 9; DrawnBy: RS485; Engineer: Laurie Biddulph; PageSetup: Record=PageOptions|CenterHorizontal=True|CenterVertical=True|PrintScale=1.38|XCorrection=1.00|YCorrection=1.00|PrintKind=1|BorderSize=5000000|LeftOffset=0|BottomOffset=0|Orientation=2|PaperLength=1000|PaperWidth=1000|Scale=100|PaperSource=7|PrintQuality=-4|MediaType=1|DitherType=10|PaperKind=A3|PrintScaleMode=1
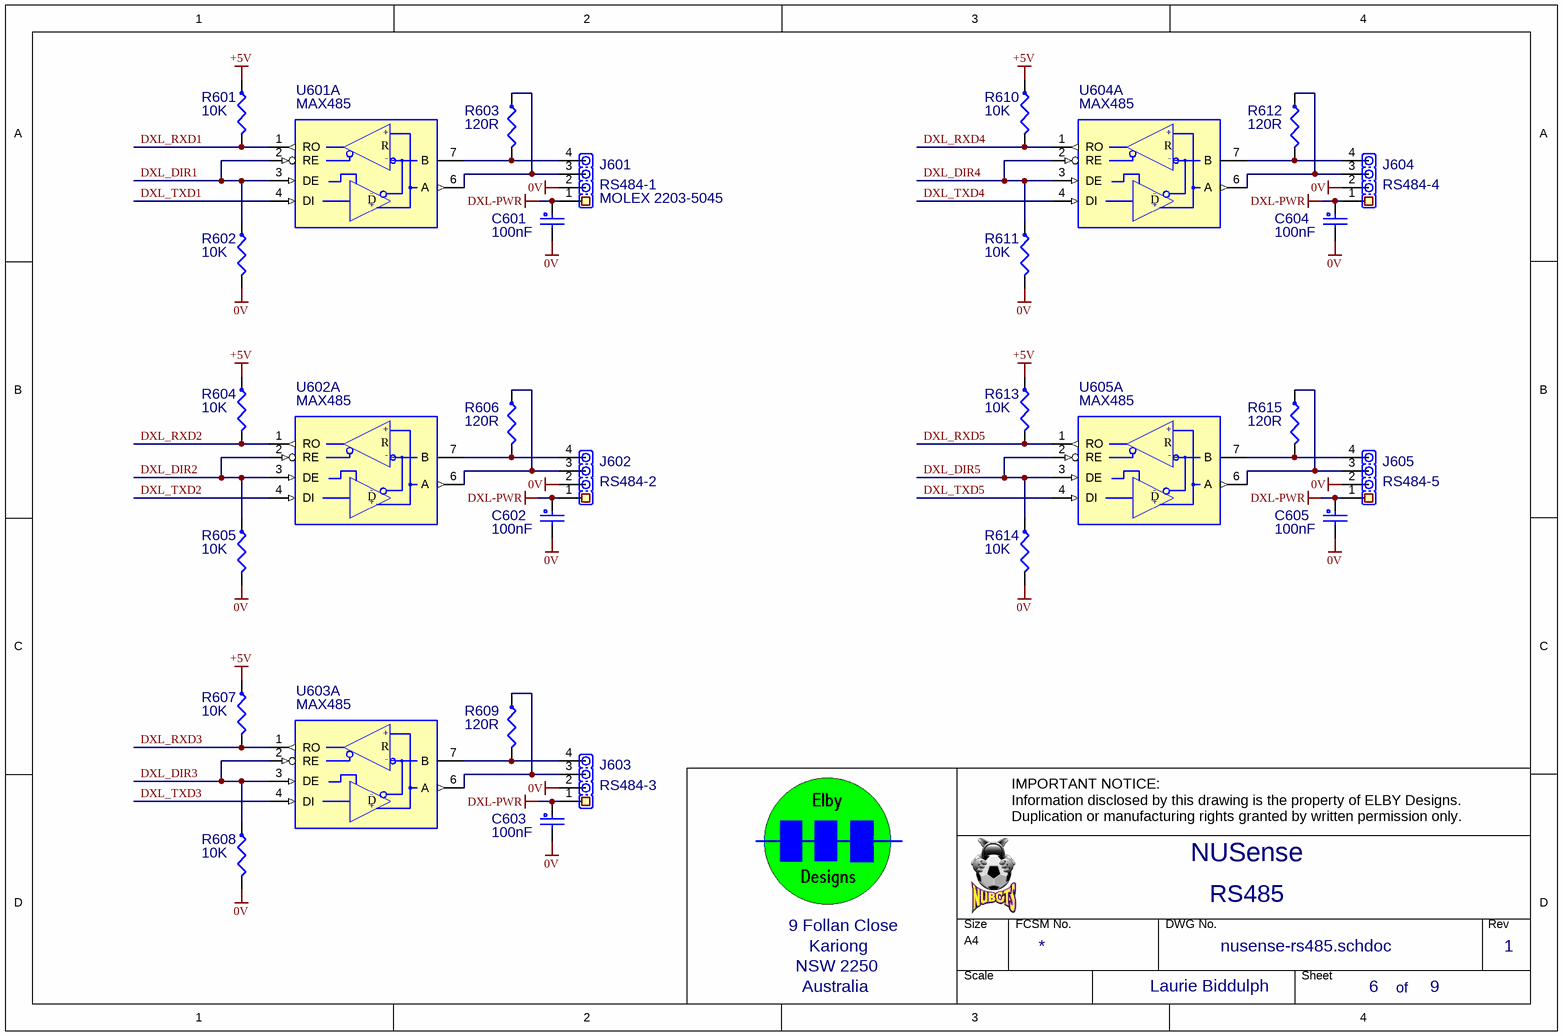
[diagram p7: nusense-rs485.schdoc]

### Parts
C601  100nF  [RAD-0.2N(LB)]
C602  100nF  [RAD-0.2N(LB)]
C603  100nF  [RAD-0.2N(LB)]
C604  100nF  [RAD-0.2N(LB)]
C605  100nF  [RAD-0.2N(LB)]
J601  RS484-1  PART: MOLEX 2203-5045  [HDR1X4(LB)]
J602  RS484-2  [HDR1X4(LB)]
J603  RS484-3  [HDR1X4(LB)]
J604  RS484-4  [HDR1X4(LB)]
J605  RS484-5  [HDR1X4(LB)]
R601  10K  [AXIAL-0.4(LB)]
R602  10K  [AXIAL-0.4(LB)]
R603  120R  [AXIAL-0.4(LB)]
R604  10K  [AXIAL-0.4(LB)]
R605  10K  [AXIAL-0.4(LB)]
R606  120R  [AXIAL-0.4(LB)]
R607  10K  [AXIAL-0.4(LB)]
R608  10K  [AXIAL-0.4(LB)]
R609  120R  [AXIAL-0.4(LB)]
R610  10K  [AXIAL-0.4(LB)]
R611  10K  [AXIAL-0.4(LB)]
R612  120R  [AXIAL-0.4(LB)]
R613  10K  [AXIAL-0.4(LB)]
R614  10K  [AXIAL-0.4(LB)]
R615  120R  [AXIAL-0.4(LB)]
U601  MAX485  [DIP-8(LB)]  (part A of 2)
U602  MAX485  [DIP-8(LB)]  (part A of 2)
U603  MAX485  [DIP-8(LB)]  (part A of 2)
U604  MAX485  [DIP-8(LB)]  (part A of 2)
U605  MAX485  [DIP-8(LB)]  (part A of 2)

### Nets
0V: C601.2 C602.2 C603.2 C604.2 C605.2 J601.2 J602.2 J603.2 J604.2 J605.2 R602.2 R605.2 R608.2 R611.2 R614.2
+5V: R601.1 R604.1 R607.1 R610.1 R613.1
DXL-PWR: C601.1 C602.1 C603.1 C604.1 C605.1 J601.1 J602.1 J603.1 J604.1 J605.1
DXL_DIR1: R602.1 U601.2(RE) U601.3(DE)
DXL_DIR2: R605.1 U602.2(RE) U602.3(DE)
DXL_DIR3: R608.1 U603.2(RE) U603.3(DE)
DXL_DIR4: R611.1 U604.2(RE) U604.3(DE)
DXL_DIR5: R614.1 U605.2(RE) U605.3(DE)
DXL_RXD1: R601.2 U601.1(RO)
DXL_RXD2: R604.2 U602.1(RO)
DXL_RXD3: R607.2 U603.1(RO)
DXL_RXD4: R610.2 U604.1(RO)
DXL_RXD5: R613.2 U605.1(RO)
DXL_TXD1: U601.4(DI)
DXL_TXD2: U602.4(DI)
DXL_TXD3: U603.4(DI)
DXL_TXD4: U604.4(DI)
DXL_TXD5: U605.4(DI)
NetJ601_3: J601.3 R603.1 U601.6(A)
NetJ601_4: J601.4 R603.2 U601.7(B)
NetJ602_3: J602.3 R606.1 U602.6(A)
NetJ602_4: J602.4 R606.2 U602.7(B)
NetJ603_3: J603.3 R609.1 U603.6(A)
NetJ603_4: J603.4 R609.2 U603.7(B)
NetJ604_3: J604.3 R612.1 U604.6(A)
NetJ604_4: J604.4 R612.2 U604.7(B)
NetJ605_3: J605.3 R615.1 U605.6(A)
NetJ605_4: J605.4 R615.2 U605.7(B)

### Notes on the sheet
- IMPORTANT NOTICE:
  Information disclosed by this drawing is the property of ELBY Designs.
  Duplication or manufacturing rights granted by written permission only.
- of
- (in symbol MAX485(LB), part A) +; R; -; D

### Library data of the parts
C601-C605 = CC-100NF(LB): Monolithic Ceramic; EMRP: CC-100NF
J601-J605 = HEADER-1X4: 1x4 Header; EMRP: JH-1X4
R601 R602 R604 R605 R607 R608 R610 R611 R613 R614 = RM-10K(LB): as R101 on sheet nusense-controller
R603 R606 R609 R612 R615 = RM-120R(LB): 0.5W 1% Metal Film Resistor; EMRP: RM-120R
U601-U605 = MAX485(LB): as U601 on sheet nusense-power-decoupling

## Sheet nusense-user-io.schdoc: NUSense
size A4; Organization: Elby Designs; Address1: 9 Follan Close; Address2: Kariong; Address3: NSW 2250; Address4: Australia; Revision: 1; SheetNumber: 5; SheetTotal: 9; DrawnBy: User Interface; Engineer: Laurie Biddulph; PageSetup: Record=PageOptions|CenterHorizontal=True|CenterVertical=True|PrintScale=1.38|XCorrection=1.00|YCorrection=1.00|PrintKind=1|BorderSize=5000000|LeftOffset=0|BottomOffset=0|Orientation=2|PaperLength=1000|PaperWidth=1000|Scale=100|PaperSource=7|PrintQuality=-4|MediaType=1|DitherType=10|PaperKind=A3|PrintScaleMode=1
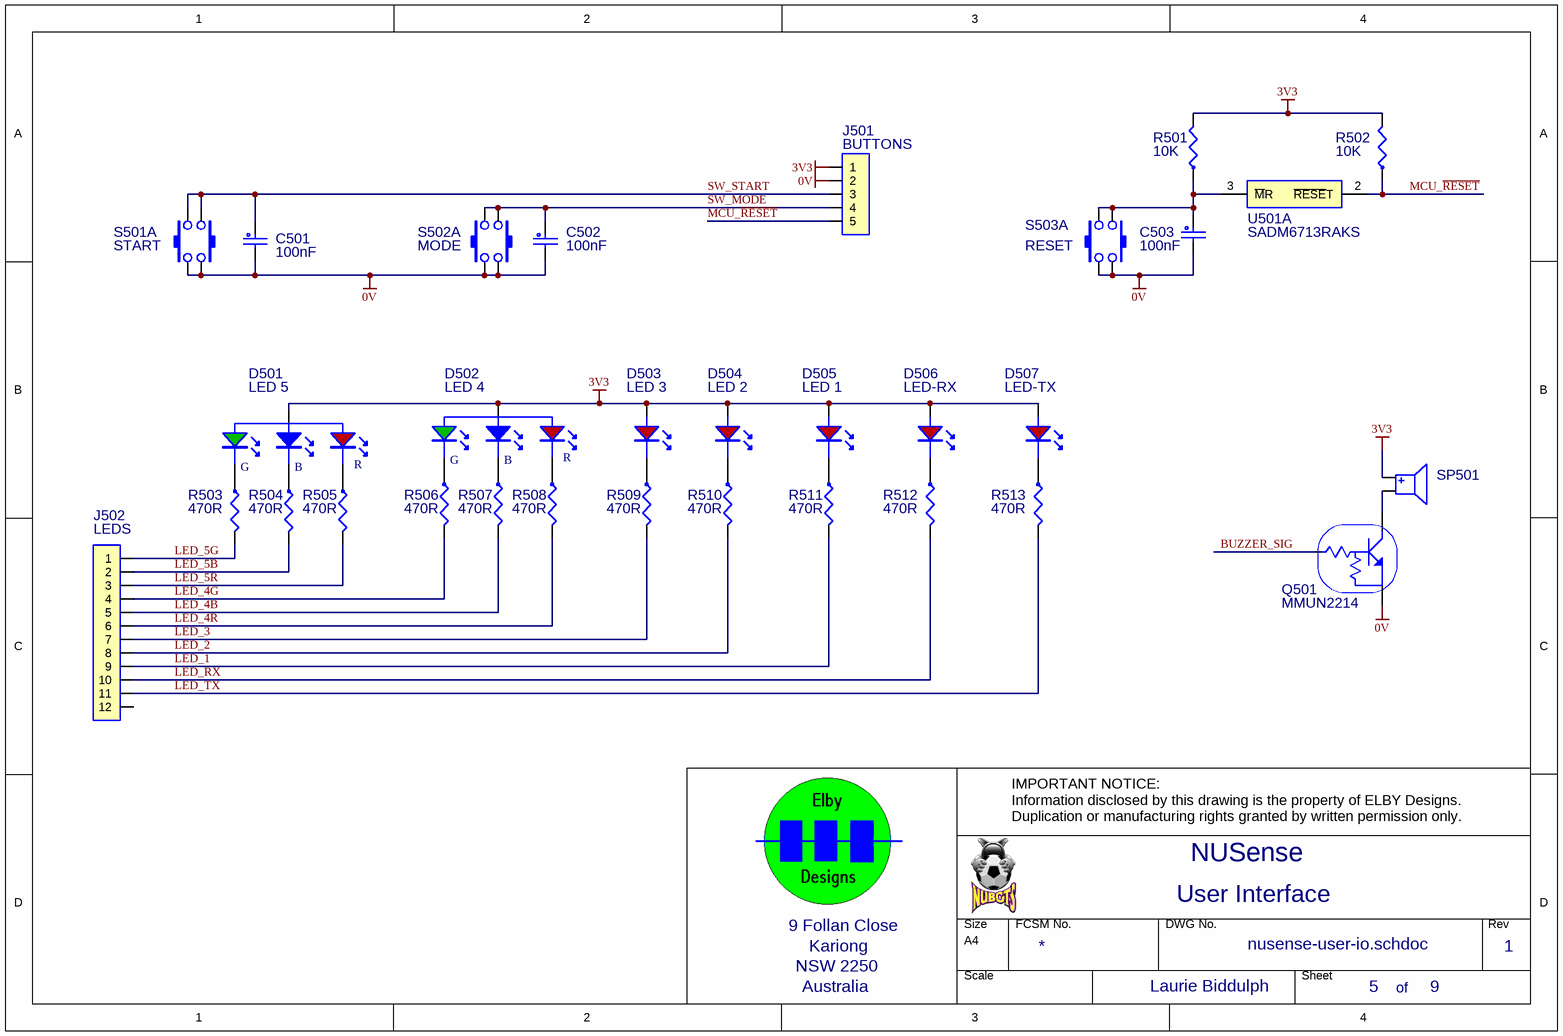
[diagram p8: nusense-user-io.schdoc]

### Parts
C501  100nF  [RAD-0.2N(LB)]
C502  100nF  [RAD-0.2N(LB)]
C503  100nF  [RAD-0.2N(LB)]
D501  LED 5  [LED-RGB(LB)]
D502  LED 4  [LED-RGB(LB)]
D503  LED 3  [LED-PCB(LB)]
D504  LED 2  [LED-PCB(LB)]
D505  LED 1  [LED-PCB(LB)]
D506  LED-RX  [LED-PCB(LB)]
D507  LED-TX  [LED-PCB(LB)]
J501  BUTTONS  [TERM254-5(LB)]
J502  LEDS
Q501  MMUN2214  [SOT-23(LB)]
R501  10K  [AXIAL-0.4(LB)]
R502  10K  [AXIAL-0.4(LB)]
R503  470R  [AXIAL-0.4(LB)]
R504  470R  [AXIAL-0.4(LB)]
R505  470R  [AXIAL-0.4(LB)]
R506  470R  [AXIAL-0.4(LB)]
R507  470R  [AXIAL-0.4(LB)]
R508  470R  [AXIAL-0.4(LB)]
R509  470R  [AXIAL-0.4(LB)]
R510  470R  [AXIAL-0.4(LB)]
R511  470R  [AXIAL-0.4(LB)]
R512  470R  [AXIAL-0.4(LB)]
R513  470R  [AXIAL-0.4(LB)]
S501  START  [PCB-PB(LB)]  (parts A,B of 2)
S502  MODE  [PCB-PB(LB)]  (parts A,B of 2)
S503  RESET  [PCB-PB(LB)]  (parts A,B of 2)
SP501  *  [MTA-2V(LB)]  (value not drawn)
U501  SADM6713RAKS  (part A of 2)

### Nets
0V: C501.2 C502.2 C503.2 J501.2 Q501.2(E) S501.1(COM) S501.3(COM) S502.1(COM) S502.3(COM) S503.1(COM) S503.3(COM)
3V3: D501.1(A) D502.1(A) D503.A D504.A D505.A D506.A D507.A J501.1 R501.2 R502.2 SP501.1
BUZZER_SIG: Q501.1(B)
LED_1: J502.9 R511.2
LED_2: J502.8 R510.2
LED_3: J502.7 R509.2
LED_4B: J502.5 R507.2
LED_4G: J502.4 R506.2
LED_4R: J502.6 R508.2
LED_5B: J502.2 R504.2
LED_5G: J502.1 R503.2
LED_5R: J502.3 R505.2
LED_RX: J502.10 R512.2
LED_TX: J502.11 R513.2
MCU_~{RESET}: J501.5 R502.1 U501.2(~{RESE}T)
SW_MODE: C502.1 J501.4 S502.2(NO) S502.4(NO)
SW_START: C501.1 J501.3 S501.2(NO) S501.4(NO)
NetC503_1: C503.1 R501.1 S503.2(NO) S503.4(NO) U501.3(~{M}R)
NetD501_2: D501.2(KG) R503.1
NetD501_3: D501.3(KB) R504.1
NetD501_4: D501.4(KR) R505.1
NetD502_2: D502.2(KG) R506.1
NetD502_3: D502.3(KB) R507.1
NetD502_4: D502.4(KR) R508.1
NetD503_K: D503.K R509.1
NetD504_K: D504.K R510.1
NetD505_K: D505.K R511.1
NetD506_K: D506.K R512.1
NetD507_K: D507.K R513.1
NetQ501_3: Q501.3(C) SP501.2

Not connected (* = marked no-connect by the designer): J502 12

### Notes on the sheet
- IMPORTANT NOTICE:
  Information disclosed by this drawing is the property of ELBY Designs.
  Duplication or manufacturing rights granted by written permission only.
- of
- (in symbol LED-RGB-CA(LB)) R; G; B

### Library data of the parts
C501-C503 = CC-100NF(LB): Monolithic Ceramic; EMRP: CC-100NF
D501 D502 = LED-RGB-CA(LB): RGB LED
D503-D507 = LED-RED(LB): LED
J501 = CON5(LB)
J502 = CON12(LB)
Q501 = MMUN2214LT1(SMD): as Q301 on sheet nusense-otg_hs_usb
R501 R502 = RM-10K(LB): as R101 on sheet nusense-controller
R503-R513 = RM-470R(LB): 0.5W 1% Metal Film Resistor; EMRP: RM-470R
S501-S503 = SW-PB-DPST(LB)
SP501 = SPEAKER(LB): Text Field1: OriginalName SPEAKER; Text Field2: Description
U501 = ADM6713

## Nets that join several sheets
0V: nusense-controller (R102.2), nusense-fans (5 pins), nusense-monitors (10 pins), nusense-mup-sensor (C201.2 U201.1 U201.11), nusense-otg_hs_usb (19 pins), nusense-power (18 pins), nusense-power-decoupling (56 pins), nusense-rs485 (15 pins), nusense-user-io (11 pins)
3V3: nusense-controller (R101.2), nusense-fans (10 pins), nusense-monitors (C703.1 U702.8), nusense-mup-sensor (R201.2 R202.2 U201.9), nusense-otg_hs_usb (D301.A D302.A R302.2 R312.1), nusense-power (C810.1 C811.1 U801.2 U801.TAB), nusense-power-decoupling (14 pins), nusense-user-io (11 pins)
+5V: nusense-otg_hs_usb (5 pins), nusense-power (C809.1 U801.3), nusense-power-decoupling (12 pins), nusense-rs485 (5 pins)
BATT+: nusense-monitors (U701.1 U701.2), nusense-power (9 pins)
BATT-: nusense-monitors (U701.3 U701.4), nusense-power (J803.1)
BUZZER_SIG: nusense-controller (U101.54), nusense-user-io (Q501.1)
D0: nusense-controller (U101.37), nusense-otg_hs_usb (U301.24)
D1: nusense-controller (U101.46), nusense-otg_hs_usb (U301.23)
D2: nusense-controller (U101.47), nusense-otg_hs_usb (U301.22)
D3: nusense-controller (U101.135), nusense-otg_hs_usb (U301.21)
D4: nusense-controller (U101.69), nusense-otg_hs_usb (U301.20)
D5: nusense-controller (U101.70), nusense-otg_hs_usb (U301.19)
D6: nusense-controller (U101.73), nusense-otg_hs_usb (U301.18)
D7: nusense-controller (U101.74), nusense-otg_hs_usb (U301.17)
DXL_DIR1: nusense-controller (U101.103), nusense-rs485 (R602.1 U601.2 U601.3)
DXL_DIR2: nusense-controller (U101.123), nusense-rs485 (R605.1 U602.2 U602.3)
DXL_DIR3: nusense-controller (U101.99), nusense-rs485 (R608.1 U603.2 U603.3)
DXL_DIR4: nusense-controller (U101.117), nusense-rs485 (R611.1 U604.2 U604.3)
DXL_DIR5: nusense-controller (U101.118), nusense-rs485 (R614.1 U605.2 U605.3)
DXL_PWR_EN: nusense-controller (U101.55), nusense-power (Q801.1)
DXL_RXD1: nusense-controller (U101.137), nusense-rs485 (R601.2 U601.1)
DXL_RXD2: nusense-controller (U101.122), nusense-rs485 (R604.2 U602.1)
DXL_RXD3: nusense-controller (U101.112), nusense-rs485 (R607.2 U603.1)
DXL_RXD4: nusense-controller (U101.116), nusense-rs485 (R610.2 U604.1)
DXL_RXD5: nusense-controller (U101.124), nusense-rs485 (R613.2 U605.1)
DXL_TXD1: nusense-controller (U101.136), nusense-rs485 (U601.4)
DXL_TXD2: nusense-controller (U101.119), nusense-rs485 (U602.4)
DXL_TXD3: nusense-controller (U101.111), nusense-rs485 (U603.4)
DXL_TXD4: nusense-controller (U101.113), nusense-rs485 (U604.4)
DXL_TXD5: nusense-controller (U101.129), nusense-rs485 (U605.4)
LED_1: nusense-controller (U101.125), nusense-user-io (J502.9 R511.2)
LED_2: nusense-controller (U101.126), nusense-user-io (J502.8 R510.2)
LED_3: nusense-controller (U101.127), nusense-user-io (J502.7 R509.2)
LED_4B: nusense-controller (U101.101), nusense-user-io (J502.5 R507.2)
LED_4G: nusense-controller (U101.100), nusense-user-io (J502.4 R506.2)
LED_4R: nusense-controller (U101.102), nusense-user-io (J502.6 R508.2)
LED_5B: nusense-controller (U101.97), nusense-user-io (J502.2 R504.2)
LED_5G: nusense-controller (U101.96), nusense-user-io (J502.1 R503.2)
LED_5R: nusense-controller (U101.98), nusense-user-io (J502.3 R505.2)
LED_RX: nusense-controller (U101.128), nusense-user-io (J502.10 R512.2)
LED_TX: nusense-controller (U101.93), nusense-user-io (J502.11 R513.2)
MCU_~{RESET}: nusense-controller (U101.25), nusense-user-io (J501.5 R502.1 U501.2)
MPU_SPI_CLK: nusense-controller (U101.10), nusense-mup-sensor (U201.23)
MPU_SPI_INT: nusense-controller (U101.12), nusense-mup-sensor (U201.12)
MPU_SPI_SDI: nusense-controller (U101.11), nusense-mup-sensor (R201.1 R202.1 U201.24)
OTG_HS_ULPI_CLK: nusense-controller (U101.41), nusense-otg_hs_usb (R305.1)
OTG_HS_ULPI_DIR: nusense-controller (U101.28), nusense-otg_hs_usb (R307.1)
OTG_HS_ULPI_NXT: nusense-controller (U101.29), nusense-otg_hs_usb (R308.1)
OTG_HS_ULPI_STP: nusense-controller (U101.26), nusense-otg_hs_usb (R306.1)
SW_MODE: nusense-controller (U101.92), nusense-user-io (C502.1 J501.4 S502.2 S502.4)
SW_START: nusense-controller (U101.91), nusense-user-io (C501.1 J501.3 S501.2 S501.4)
VS_ALERT: nusense-controller (U101.80), nusense-monitors (R702.2 U702.20)
VS_SCL: nusense-controller (U101.81), nusense-monitors (U702.5)
VS_SDA: nusense-controller (U101.82), nusense-monitors (U702.4)